# Altium schematic sheet USB-C_Messdaten.SchDoc
size A4; SheetNumber: 2; SheetTotal: 1
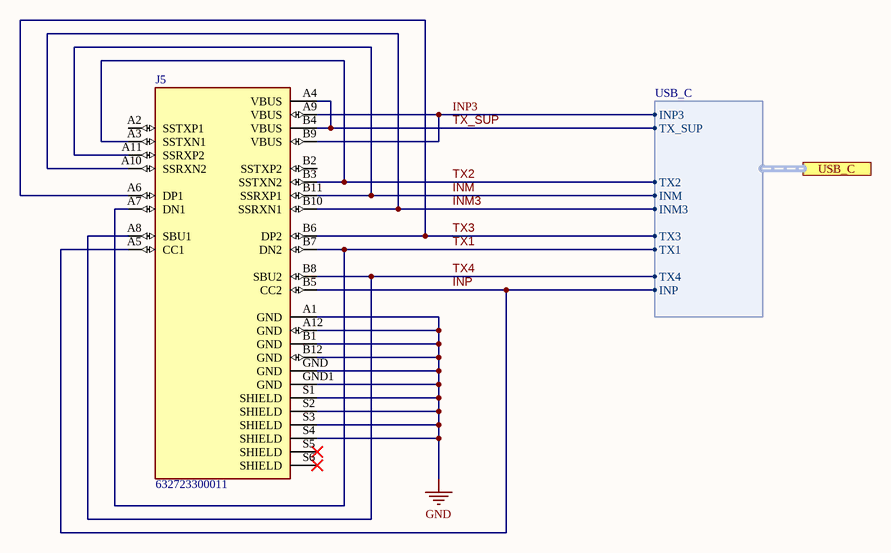
[diagram p0: USB-C_Messdaten.SchDoc]

## Parts
J5  632723300011  [WURTH_632723X00011]

## Ports
USB_C (harness USB_C)

## Harnesses
USB_C: INP, INM, INM3, INP3, TX4, TX1, TX3, TX2, TX_SUP

## Nets
GND: J5.A1(GND) J5.A12(GND) J5.B1(GND) J5.B12(GND) J5.GND J5.GND1(GND) J5.S1(SHIELD) J5.S2(SHIELD) J5.S3(SHIELD) J5.S4(SHIELD)
INM: J5.A11(SSRXP2) J5.B11(SSRXP1) ; port USB_C.INM
INM3: J5.A10(SSRXN2) J5.B10(SSRXN1) ; port USB_C.INM3
INP: J5.A5(CC1) J5.B5(CC2) ; port USB_C.INP
INP3: J5.A9(VBUS) J5.B9(VBUS) ; port USB_C.INP3
TX1: J5.A7(DN1) J5.B7(DN2) ; port USB_C.TX1
TX2: J5.A3(SSTXN1) J5.B3(SSTXN2) ; port USB_C.TX2
TX3: J5.A6(DP1) J5.B6(DP2) ; port USB_C.TX3
TX4: J5.A8(SBU1) J5.B8(SBU2) ; port USB_C.TX4
TX_SUP: J5.A4(VBUS) J5.B4(VBUS) ; port USB_C.TX_SUP

Not connected (* = marked no-connect by the designer): J5 A2(SSTXP1) B2(SSTXP2) S5(SHIELD)* S6(SHIELD)*

## Library data of the parts
J5 = 632723300011: USB-C (USB TYPE-C) USB 3.2 Gen 2 (USB 3.1 Gen 2, Superspeed + (USB 3.1)) Receptacle Connector 24 Position Surface Mount, Right Angle; Through Hole; MF: Wurth Elektronik; Value: *; Check_prices: https://www.snapeda.com/parts/632723300011/Wurth+Elektronik/view-part/?ref=eda; SnapEDA_Link: https://www.snapeda.com/parts/632723300011/Wurth+Elektronik/view-part/?ref=snap; Availability: In Stock; MP: 632723300011; Purchase-URL: https://pricing.snapeda.com/search/part/632723300011/?ref=eda; Package: None; Price: None